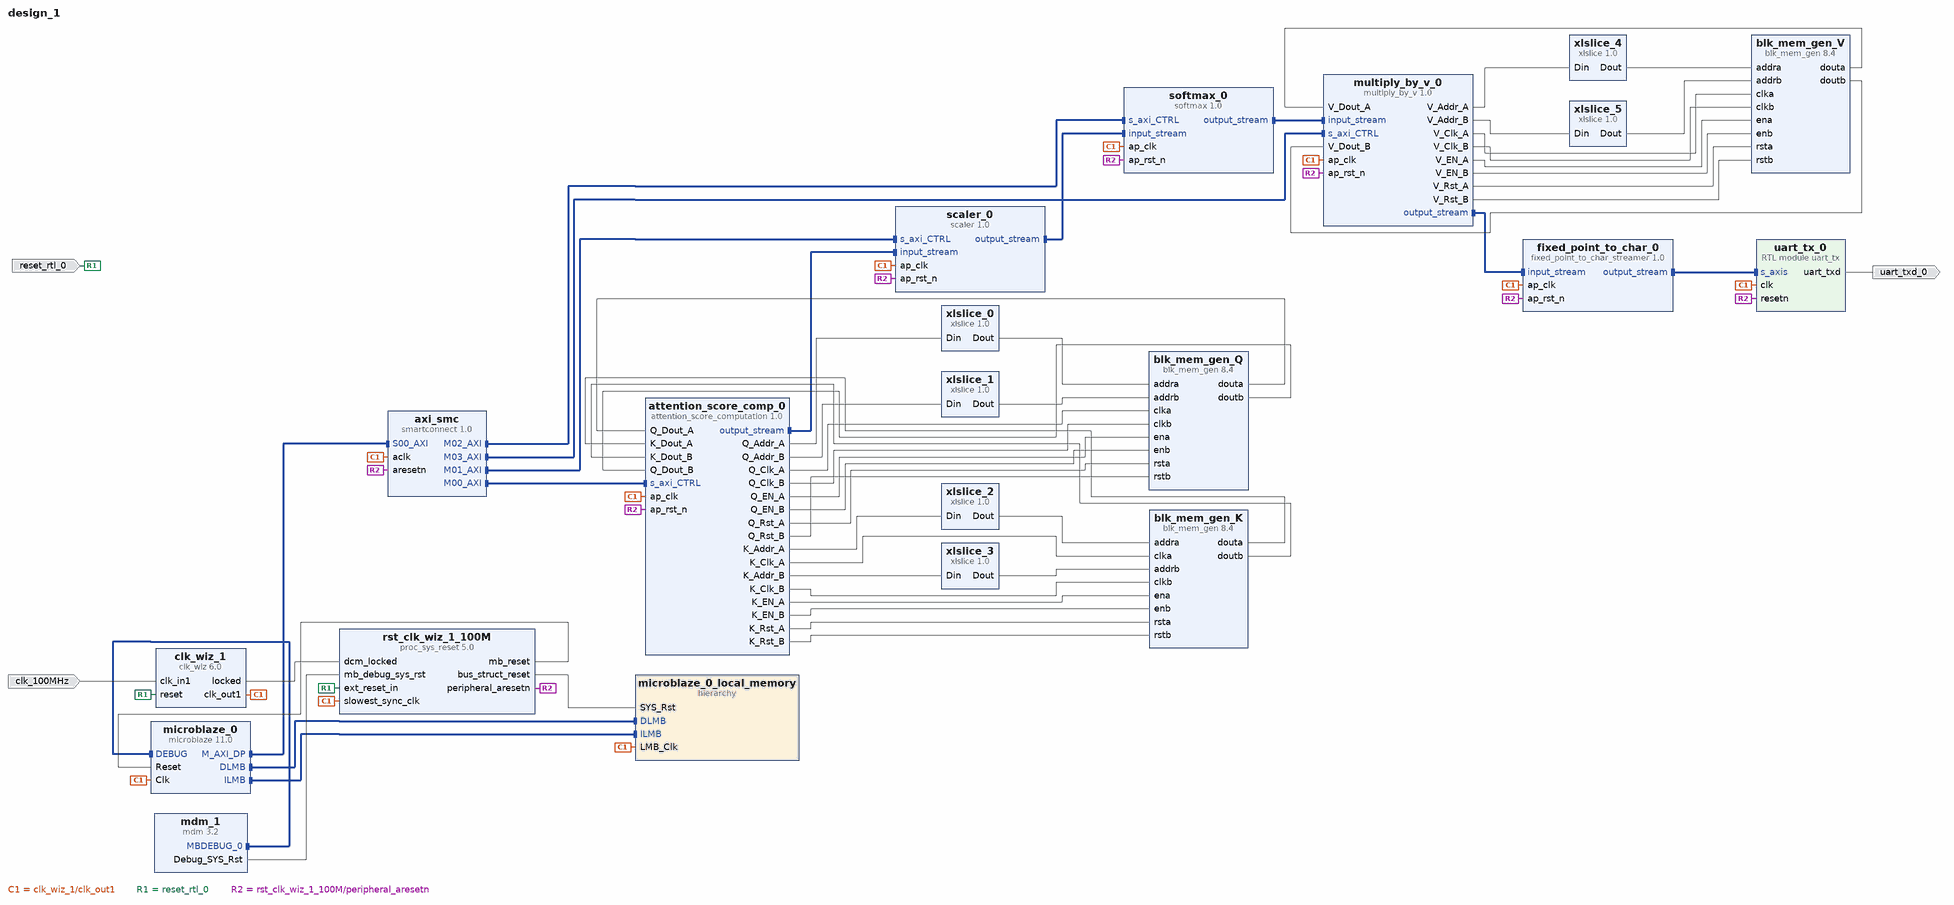
[diagram p0: block diagram of the top level]
# Vivado block design design_1, xc7a35tcpg236-1, Vivado 2025.1
create_bd_design design_1

create_bd_port -dir I -type clk clk_100MHz
set_property -dict {CONFIG.FREQ_HZ 100000000} [get_bd_ports clk_100MHz]
create_bd_port -dir I -type rst reset_rtl_0
set_property -dict {CONFIG.POLARITY ACTIVE_HIGH} [get_bd_ports reset_rtl_0]
create_bd_port -dir O uart_txd_0

create_bd_cell -type ip -vlnv xilinx.com:ip:microblaze:11.0 microblaze_0
set_property -dict [list \
  CONFIG.C_DEBUG_ENABLED 1 \
  CONFIG.C_D_AXI 1 \
  CONFIG.C_D_LMB 1 \
  CONFIG.C_ENABLE_CONVERSION 0 \
  CONFIG.C_I_LMB 1 \
] [get_bd_cells microblaze_0]
create_bd_cell -type hier microblaze_0_local_memory
create_bd_cell -type ip -vlnv xilinx.com:ip:mdm:3.2 mdm_1
create_bd_cell -type ip -vlnv xilinx.com:ip:clk_wiz:6.0 clk_wiz_1
set_property -dict {CONFIG.PRIM_SOURCE Single_ended_clock_capable_pin} [get_bd_cells clk_wiz_1]
create_bd_cell -type ip -vlnv xilinx.com:ip:proc_sys_reset:5.0 rst_clk_wiz_1_100M
create_bd_cell -type ip -vlnv xilinx.com:ip:blk_mem_gen:8.4 blk_mem_gen_Q
set_property -dict [list \
  CONFIG.Memory_Type Dual_Port_ROM \
  CONFIG.Register_PortA_Output_of_Memory_Primitives false \
  CONFIG.Register_PortB_Output_of_Memory_Primitives false \
  CONFIG.Use_RSTA_Pin true \
  CONFIG.Use_RSTB_Pin true \
  CONFIG.Write_Depth_A 12608 \
  CONFIG.Write_Width_A 8 \
  CONFIG.use_bram_block Stand_Alone \
] [get_bd_cells blk_mem_gen_Q]
create_bd_cell -type ip -vlnv xilinx.com:ip:blk_mem_gen:8.4 blk_mem_gen_K
set_property -dict [list \
  CONFIG.Memory_Type Dual_Port_ROM \
  CONFIG.Register_PortA_Output_of_Memory_Primitives false \
  CONFIG.Register_PortB_Output_of_Memory_Primitives false \
  CONFIG.Use_RSTA_Pin true \
  CONFIG.Use_RSTB_Pin true \
  CONFIG.Write_Depth_A 12608 \
  CONFIG.Write_Width_A 8 \
  CONFIG.use_bram_block Stand_Alone \
] [get_bd_cells blk_mem_gen_K]
create_bd_cell -type ip -vlnv xilinx.com:ip:blk_mem_gen:8.4 blk_mem_gen_V
set_property -dict [list \
  CONFIG.Memory_Type Dual_Port_ROM \
  CONFIG.Register_PortA_Output_of_Memory_Primitives false \
  CONFIG.Register_PortB_Output_of_Memory_Primitives false \
  CONFIG.Use_RSTA_Pin true \
  CONFIG.Use_RSTB_Pin true \
  CONFIG.Write_Depth_A 12608 \
  CONFIG.Write_Width_A 8 \
  CONFIG.use_bram_block Stand_Alone \
] [get_bd_cells blk_mem_gen_V]
create_bd_cell -type ip -vlnv xilinx.com:hls:attention_score_computation:1.0 attention_score_comp_0
create_bd_cell -type ip -vlnv xilinx.com:ip:xlslice:1.0 xlslice_0
set_property -dict {CONFIG.DIN_FROM 13} [get_bd_cells xlslice_0]
create_bd_cell -type ip -vlnv xilinx.com:ip:xlslice:1.0 xlslice_1
set_property -dict {CONFIG.DIN_FROM 13} [get_bd_cells xlslice_1]
create_bd_cell -type ip -vlnv xilinx.com:ip:xlslice:1.0 xlslice_2
set_property -dict {CONFIG.DIN_FROM 13} [get_bd_cells xlslice_2]
create_bd_cell -type ip -vlnv xilinx.com:ip:xlslice:1.0 xlslice_3
set_property -dict {CONFIG.DIN_FROM 13} [get_bd_cells xlslice_3]
create_bd_cell -type ip -vlnv xilinx.com:ip:smartconnect:1.0 axi_smc
set_property -dict {CONFIG.NUM_MI 4 CONFIG.NUM_SI 1} [get_bd_cells axi_smc]
create_bd_cell -type ip -vlnv xilinx.com:hls:scaler:1.0 scaler_0
create_bd_cell -type ip -vlnv xilinx.com:hls:softmax:1.0 softmax_0
create_bd_cell -type ip -vlnv xilinx.com:hls:multiply_by_v:1.0 multiply_by_v_0
create_bd_cell -type ip -vlnv xilinx.com:ip:xlslice:1.0 xlslice_4
set_property -dict {CONFIG.DIN_FROM 13} [get_bd_cells xlslice_4]
create_bd_cell -type ip -vlnv xilinx.com:ip:xlslice:1.0 xlslice_5
set_property -dict {CONFIG.DIN_FROM 13} [get_bd_cells xlslice_5]
create_bd_cell -type ip -vlnv xilinx.com:hls:fixed_point_to_char_streamer:1.0 fixed_point_to_char_0
create_bd_cell -type module -reference uart_tx uart_tx_0

# ---- hierarchy /microblaze_0_local_memory ----
current_bd_instance /microblaze_0_local_memory
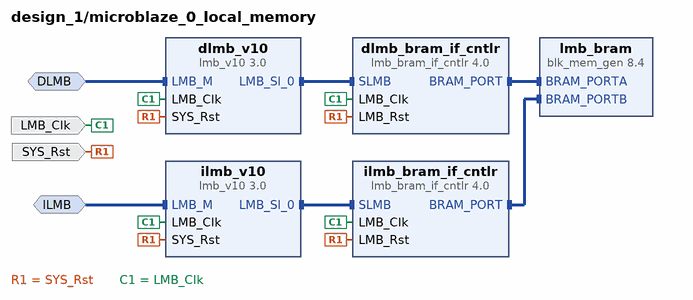
[diagram p1: block diagram inside /microblaze_0_local_memory]
create_bd_intf_pin -mode MirroredMaster -vlnv xilinx.com:interface:lmb_rtl:1.0 DLMB
create_bd_intf_pin -mode MirroredMaster -vlnv xilinx.com:interface:lmb_rtl:1.0 ILMB
create_bd_pin -dir I -type clk LMB_Clk
create_bd_pin -dir I -type rst SYS_Rst

create_bd_cell -type ip -vlnv xilinx.com:ip:lmb_v10:3.0 dlmb_v10
create_bd_cell -type ip -vlnv xilinx.com:ip:lmb_v10:3.0 ilmb_v10
create_bd_cell -type ip -vlnv xilinx.com:ip:lmb_bram_if_cntlr:4.0 dlmb_bram_if_cntlr
set_property -dict {CONFIG.C_ECC 0} [get_bd_cells dlmb_bram_if_cntlr]
create_bd_cell -type ip -vlnv xilinx.com:ip:lmb_bram_if_cntlr:4.0 ilmb_bram_if_cntlr
set_property -dict {CONFIG.C_ECC 0} [get_bd_cells ilmb_bram_if_cntlr]
create_bd_cell -type ip -vlnv xilinx.com:ip:blk_mem_gen:8.4 lmb_bram
set_property -dict {CONFIG.Memory_Type True_Dual_Port_RAM CONFIG.use_bram_block BRAM_Controller} [get_bd_cells lmb_bram]

# ---- connections ----

current_bd_instance /microblaze_0_local_memory
connect_bd_intf_net -intf_net microblaze_0_dlmb [get_bd_intf_pins dlmb_v10/LMB_M] [get_bd_intf_pins DLMB]
connect_bd_intf_net -intf_net microblaze_0_dlmb_bus [get_bd_intf_pins dlmb_v10/LMB_Sl_0] [get_bd_intf_pins dlmb_bram_if_cntlr/SLMB]
connect_bd_intf_net -intf_net microblaze_0_dlmb_cntlr [get_bd_intf_pins dlmb_bram_if_cntlr/BRAM_PORT] [get_bd_intf_pins lmb_bram/BRAM_PORTA]
connect_bd_intf_net -intf_net microblaze_0_ilmb [get_bd_intf_pins ilmb_v10/LMB_M] [get_bd_intf_pins ILMB]
connect_bd_intf_net -intf_net microblaze_0_ilmb_bus [get_bd_intf_pins ilmb_v10/LMB_Sl_0] [get_bd_intf_pins ilmb_bram_if_cntlr/SLMB]
connect_bd_intf_net -intf_net microblaze_0_ilmb_cntlr [get_bd_intf_pins ilmb_bram_if_cntlr/BRAM_PORT] [get_bd_intf_pins lmb_bram/BRAM_PORTB]
connect_bd_net [get_bd_pins SYS_Rst] \
  [get_bd_pins dlmb_v10/SYS_Rst] [get_bd_pins dlmb_bram_if_cntlr/LMB_Rst] [get_bd_pins ilmb_v10/SYS_Rst] \
  [get_bd_pins ilmb_bram_if_cntlr/LMB_Rst]
connect_bd_net -net microblaze_0_Clk [get_bd_pins LMB_Clk] \
  [get_bd_pins dlmb_v10/LMB_Clk] [get_bd_pins dlmb_bram_if_cntlr/LMB_Clk] [get_bd_pins ilmb_v10/LMB_Clk] \
  [get_bd_pins ilmb_bram_if_cntlr/LMB_Clk]

current_bd_instance /
connect_bd_intf_net [get_bd_intf_pins attention_score_comp_0/output_stream] [get_bd_intf_pins scaler_0/input_stream]
connect_bd_intf_net [get_bd_intf_pins axi_smc/M00_AXI] [get_bd_intf_pins attention_score_comp_0/s_axi_CTRL]
connect_bd_intf_net [get_bd_intf_pins axi_smc/M01_AXI] [get_bd_intf_pins scaler_0/s_axi_CTRL]
connect_bd_intf_net [get_bd_intf_pins axi_smc/M02_AXI] [get_bd_intf_pins softmax_0/s_axi_CTRL]
connect_bd_intf_net [get_bd_intf_pins axi_smc/M03_AXI] [get_bd_intf_pins multiply_by_v_0/s_axi_CTRL]
connect_bd_intf_net [get_bd_intf_pins fixed_point_to_char_0/output_stream] [get_bd_intf_pins uart_tx_0/s_axis]
connect_bd_intf_net [get_bd_intf_pins microblaze_0/M_AXI_DP] [get_bd_intf_pins axi_smc/S00_AXI]
connect_bd_intf_net [get_bd_intf_pins mdm_1/MBDEBUG_0] [get_bd_intf_pins microblaze_0/DEBUG]
connect_bd_intf_net [get_bd_intf_pins microblaze_0/DLMB] [get_bd_intf_pins microblaze_0_local_memory/DLMB]
connect_bd_intf_net [get_bd_intf_pins microblaze_0/ILMB] [get_bd_intf_pins microblaze_0_local_memory/ILMB]
connect_bd_intf_net [get_bd_intf_pins multiply_by_v_0/output_stream] [get_bd_intf_pins fixed_point_to_char_0/input_stream]
connect_bd_intf_net [get_bd_intf_pins scaler_0/output_stream] [get_bd_intf_pins softmax_0/input_stream]
connect_bd_intf_net [get_bd_intf_pins softmax_0/output_stream] [get_bd_intf_pins multiply_by_v_0/input_stream]
connect_bd_net [get_bd_pins attention_score_comp_0/K_Addr_A] [get_bd_pins xlslice_2/Din]
connect_bd_net [get_bd_pins attention_score_comp_0/K_Addr_B] [get_bd_pins xlslice_3/Din]
connect_bd_net [get_bd_pins attention_score_comp_0/K_Clk_A] [get_bd_pins blk_mem_gen_K/clka]
connect_bd_net [get_bd_pins attention_score_comp_0/K_Clk_B] [get_bd_pins blk_mem_gen_K/clkb]
connect_bd_net [get_bd_pins attention_score_comp_0/K_EN_A] [get_bd_pins blk_mem_gen_K/ena]
connect_bd_net [get_bd_pins attention_score_comp_0/K_EN_B] [get_bd_pins blk_mem_gen_K/enb]
connect_bd_net [get_bd_pins attention_score_comp_0/K_Rst_A] [get_bd_pins blk_mem_gen_K/rsta]
connect_bd_net [get_bd_pins attention_score_comp_0/K_Rst_B] [get_bd_pins blk_mem_gen_K/rstb]
connect_bd_net [get_bd_pins attention_score_comp_0/Q_Addr_A] [get_bd_pins xlslice_0/Din]
connect_bd_net [get_bd_pins attention_score_comp_0/Q_Addr_B] [get_bd_pins xlslice_1/Din]
connect_bd_net [get_bd_pins attention_score_comp_0/Q_Clk_A] [get_bd_pins blk_mem_gen_Q/clka]
connect_bd_net [get_bd_pins attention_score_comp_0/Q_Clk_B] [get_bd_pins blk_mem_gen_Q/clkb]
connect_bd_net [get_bd_pins attention_score_comp_0/Q_EN_A] [get_bd_pins blk_mem_gen_Q/ena]
connect_bd_net [get_bd_pins attention_score_comp_0/Q_EN_B] [get_bd_pins blk_mem_gen_Q/enb]
connect_bd_net [get_bd_pins attention_score_comp_0/Q_Rst_A] [get_bd_pins blk_mem_gen_Q/rsta]
connect_bd_net [get_bd_pins attention_score_comp_0/Q_Rst_B] [get_bd_pins blk_mem_gen_Q/rstb]
connect_bd_net [get_bd_pins blk_mem_gen_K/douta] [get_bd_pins attention_score_comp_0/K_Dout_A]
connect_bd_net [get_bd_pins blk_mem_gen_K/doutb] [get_bd_pins attention_score_comp_0/K_Dout_B]
connect_bd_net [get_bd_pins blk_mem_gen_Q/douta] [get_bd_pins attention_score_comp_0/Q_Dout_A]
connect_bd_net [get_bd_pins blk_mem_gen_Q/doutb] [get_bd_pins attention_score_comp_0/Q_Dout_B]
connect_bd_net [get_bd_pins blk_mem_gen_V/douta] [get_bd_pins multiply_by_v_0/V_Dout_A]
connect_bd_net [get_bd_pins blk_mem_gen_V/doutb] [get_bd_pins multiply_by_v_0/V_Dout_B]
connect_bd_net [get_bd_ports clk_100MHz] [get_bd_pins clk_wiz_1/clk_in1]
connect_bd_net [get_bd_pins clk_wiz_1/locked] [get_bd_pins rst_clk_wiz_1_100M/dcm_locked]
connect_bd_net [get_bd_pins mdm_1/Debug_SYS_Rst] [get_bd_pins rst_clk_wiz_1_100M/mb_debug_sys_rst]
connect_bd_net -net microblaze_0_Clk [get_bd_pins clk_wiz_1/clk_out1] \
  [get_bd_pins microblaze_0/Clk] [get_bd_pins microblaze_0_local_memory/LMB_Clk] \
  [get_bd_pins rst_clk_wiz_1_100M/slowest_sync_clk] [get_bd_pins axi_smc/aclk] [get_bd_pins attention_score_comp_0/ap_clk] \
  [get_bd_pins scaler_0/ap_clk] [get_bd_pins softmax_0/ap_clk] [get_bd_pins multiply_by_v_0/ap_clk] \
  [get_bd_pins fixed_point_to_char_0/ap_clk] [get_bd_pins uart_tx_0/clk]
connect_bd_net [get_bd_pins multiply_by_v_0/V_Addr_A] [get_bd_pins xlslice_4/Din]
connect_bd_net [get_bd_pins multiply_by_v_0/V_Addr_B] [get_bd_pins xlslice_5/Din]
connect_bd_net [get_bd_pins multiply_by_v_0/V_Clk_A] [get_bd_pins blk_mem_gen_V/clka]
connect_bd_net [get_bd_pins multiply_by_v_0/V_Clk_B] [get_bd_pins blk_mem_gen_V/clkb]
connect_bd_net [get_bd_pins multiply_by_v_0/V_EN_A] [get_bd_pins blk_mem_gen_V/ena]
connect_bd_net [get_bd_pins multiply_by_v_0/V_EN_B] [get_bd_pins blk_mem_gen_V/enb]
connect_bd_net [get_bd_pins multiply_by_v_0/V_Rst_A] [get_bd_pins blk_mem_gen_V/rsta]
connect_bd_net [get_bd_pins multiply_by_v_0/V_Rst_B] [get_bd_pins blk_mem_gen_V/rstb]
connect_bd_net -net reset_rtl_0_1 [get_bd_ports reset_rtl_0] [get_bd_pins clk_wiz_1/reset] [get_bd_pins rst_clk_wiz_1_100M/ext_reset_in]
connect_bd_net [get_bd_pins rst_clk_wiz_1_100M/bus_struct_reset] [get_bd_pins microblaze_0_local_memory/SYS_Rst]
connect_bd_net [get_bd_pins rst_clk_wiz_1_100M/mb_reset] [get_bd_pins microblaze_0/Reset]
connect_bd_net [get_bd_pins rst_clk_wiz_1_100M/peripheral_aresetn] \
  [get_bd_pins attention_score_comp_0/ap_rst_n] [get_bd_pins axi_smc/aresetn] [get_bd_pins scaler_0/ap_rst_n] \
  [get_bd_pins softmax_0/ap_rst_n] [get_bd_pins multiply_by_v_0/ap_rst_n] [get_bd_pins fixed_point_to_char_0/ap_rst_n] \
  [get_bd_pins uart_tx_0/resetn]
connect_bd_net [get_bd_pins uart_tx_0/uart_txd] [get_bd_ports uart_txd_0]
connect_bd_net [get_bd_pins xlslice_0/Dout] [get_bd_pins blk_mem_gen_Q/addra]
connect_bd_net [get_bd_pins xlslice_1/Dout] [get_bd_pins blk_mem_gen_Q/addrb]
connect_bd_net [get_bd_pins xlslice_2/Dout] [get_bd_pins blk_mem_gen_K/addra]
connect_bd_net [get_bd_pins xlslice_3/Dout] [get_bd_pins blk_mem_gen_K/addrb]
connect_bd_net [get_bd_pins xlslice_4/Dout] [get_bd_pins blk_mem_gen_V/addra]
connect_bd_net [get_bd_pins xlslice_5/Dout] [get_bd_pins blk_mem_gen_V/addrb]

# ---- address map ----
assign_bd_address -offset 0x00000000 -range 32K -target_address_space [get_bd_addr_spaces microblaze_0/Data] [get_bd_addr_segs microblaze_0_local_memory/dlmb_bram_if_cntlr/SLMB/Mem]
assign_bd_address -offset 0x00010000 -range 64K -target_address_space [get_bd_addr_spaces microblaze_0/Data] [get_bd_addr_segs attention_score_comp_0/s_axi_CTRL/Reg]
assign_bd_address -offset 0x00020000 -range 64K -target_address_space [get_bd_addr_spaces microblaze_0/Data] [get_bd_addr_segs scaler_0/s_axi_CTRL/Reg]
assign_bd_address -offset 0x00030000 -range 64K -target_address_space [get_bd_addr_spaces microblaze_0/Data] [get_bd_addr_segs softmax_0/s_axi_CTRL/Reg]
assign_bd_address -offset 0x00040000 -range 64K -target_address_space [get_bd_addr_spaces microblaze_0/Data] [get_bd_addr_segs multiply_by_v_0/s_axi_CTRL/Reg]
assign_bd_address -offset 0x00000000 -range 32K -target_address_space [get_bd_addr_spaces microblaze_0/Instruction] [get_bd_addr_segs microblaze_0_local_memory/ilmb_bram_if_cntlr/SLMB/Mem]

validate_bd_design
save_bd_design
